# Altium project MT3608.PrjPcb
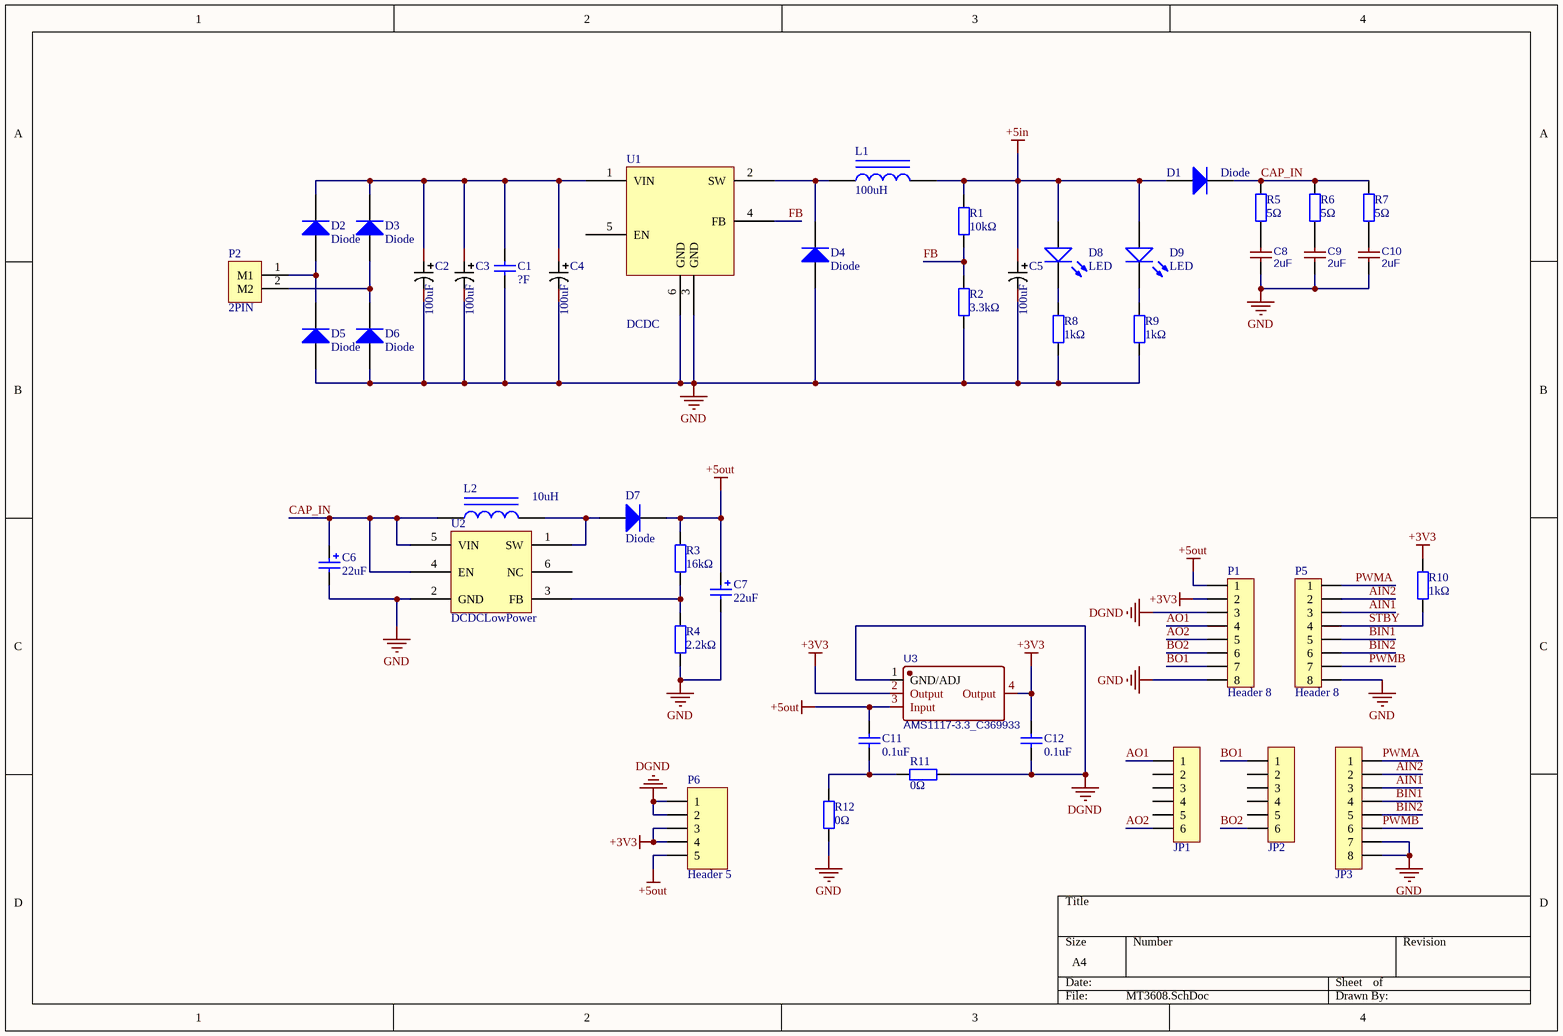
[diagram p0: MT3608.SchDoc]
1 sheet, 45 parts. Net scope: global (net labels, ports and power ports of the same name join across sheets).
Board file: MT3608.PcbDoc

## Sheet MT3608.SchDoc
size A4; SheetNumber: 1; SheetTotal: 1

### Parts
C1  ?F  [0603_C]
C2  100uF  [CM E(8*10.2)]
C3  100uF  [CM E(8*10.2)]
C4  100uF  [CM E(8*10.2)]
C5  100uF  [CM E(8*10.2)]
C6  22uF  [CASE-C_6032]
C7  22uF  [CASE-C_6032]
C8  2uF  [CAP-TH_L23.0-W10.0-P20.00-D1.4]
C9  2uF  [CAP-TH_L23.0-W10.0-P20.00-D1.4]
C10  2uF  [CAP-TH_L23.0-W10.0-P20.00-D1.4]
C11  0.1uF  [0603_C]
C12  0.1uF  [0603_C]
D1  Diode  [SMA(DO-214AC)_S1]
D2  Diode  [SMA(DO-214AC)_S2]
D3  Diode  [SMA(DO-214AC)_S2]
D4  Diode  [SMA(DO-214AC)_S1]
D5  Diode  [SMA(DO-214AC)_S2]
D6  Diode  [SMA(DO-214AC)_S2]
D7  Diode  [SMA(DO-214AC)_S1]
D8  LED  [0805_LED]
D9  LED  [0805_LED]
JP1  HDR-1X6  [HDR2.54-WS-6P]  (value not drawn)
JP2  HDR-1X6  [HDR2.54-WS-6P]  (value not drawn)
JP3  HDR-1X8  [HDR2.54-WS-8P]  (value not drawn)
L1  100uH  [CDRH127]
L2  10uH  [CDRH73]
P1  Header 8  [Header 8]
P2  2PIN  [KF128-2P]
P5  Header 8  [Header 8]
P6  Header 5  [HDR2.54-WS-5P]
R1  10kΩ  [0603_R]
R2  3.3kΩ  [0603_R]
R3  16kΩ  [0603_R]
R4  2.2kΩ  [0603_R]
R5  5Ω  [0603_R]
R6  5Ω  [0603_R]
R7  5Ω  [0603_R]
R8  1kΩ  [0603_R]
R9  1kΩ  [0603_R]
R10  1kΩ  [0603_R]
R11  0Ω  [1206_R]
R12  0Ω  [1206_R]
U1  DCDC  [TO-252-XL]
U2  DCDCLowPower  [SOT95P290X145-6N]
U3  AMS1117-3.3_C369933  [SOT-223-4_L6.5-W3.5-P2.30-LS7.0-BR]

### Nets
+3V3: C12.2 P1.2 P6.3 P6.4 R10.2 U3.2(Output) U3.4(Output)
+5in: C5.1 D1.1(A) D8.A D9.A L1.2 R1.2
+5out: C7.1 C11.2 D7.2(K) P1.1 P6.5 R3.2 U3.3(Input)
DGND: C12.1 P1.3 P6.1 P6.2 R11.1 U3.1(GND/ADJ)
GND: C1.1 C2.2 C3.2 C4.2 C5.2 C6.2 C7.2 C8.1 C9.1 C10.1 D4.1(A) D5.1(A) D6.1(A) JP3.7 JP3.8 P1.8 P5.8 R2.1 R4.1 R8.1 R9.1 R12.1 U1.3(GND) U1.6(GND) U2.2(GND)
AIN1: JP3.3 P5.3
AIN2: JP3.2 P5.2
AO1: JP1.1 P1.4
AO2: JP1.6 P1.5
BIN1: JP3.4 P5.5
BIN2: JP3.5 P5.6
BO1: JP2.1 P1.7
BO2: JP2.6 P1.6
CAP_IN: C6.1 D1.2(K) L2.1 R5.2 R6.2 R7.2 U2.4(EN) U2.5(VIN)
FB: R1.1 R2.2 U1.4(FB)
PWMA: JP3.1 P5.1
PWMB: JP3.6 P5.7
STBY: P5.4 R10.1
NetC1_2: C1.2 C2.1 C3.1 C4.1 D2.2(K) D3.2(K) U1.1(VIN)
NetC8_2: C8.2 R5.1
NetC9_2: C9.2 R6.1
NetC10_2: C10.2 R7.1
NetC11_1: C11.1 R11.2 R12.2
NetD2_1: D2.1(A) D5.2(K) P2.1(M1)
NetD3_1: D3.1(A) D6.2(K) P2.2(M2)
NetD4_2: D4.2(K) L1.1 U1.2(SW)
NetD7_1: D7.1(A) L2.2 U2.1(SW)
NetD8_K: D8.K R8.2
NetD9_K: D9.K R9.2
NetR3_1: R3.1 R4.2 U2.3(FB)

Not connected (* = marked no-connect by the designer): JP1 2 3 4 5; JP2 2 3 4 5; U1 5(EN); U2 6(NC)

### Library data of the parts
C1 C11 C12 = SMT_Cap: 贴片电容; ComponentLink1Description: 供应商链接; ComponentLink1URL: http://www.szlcsc.com/product/details_29010.html; Package: 0805; Supplier: LC; SuppliersPartNumber: C28260
C2-C5 = SMT_Cap_Electrolytic: 贴片电容; ComponentLink1Description: 供应商链接; ComponentLink1URL: http://www.szlcsc.com/product/details_29010.html; Package: 0805; Supplier: LC; SuppliersPartNumber: C28260
C6 C7 = SMT_Cap_Tantalum: 钽电容; ComponentLink1Description: 供应商链接; ComponentLink1URL: http://www.szlcsc.com/product/details_16815.html; Package: 3528; Supplier: LC; SuppliersPartNumber: C16133
C8-C10 = 2uF-CBB: CBB，2uF电容; BOM_Manufacturer: SRD; BOM_Manufacturer Part: MPP205J4241119LC; nameAlias: Capacitance; BOM_Supplier: LCSC; BOM_Supplier Part: C93266; BOM_JLCPCB Part Class: Extended Part; spicePre: C; spiceSymbolName: MPP205J4241119LC
D1-D7 = Diode: 通用二极管; ComponentLink1Description: 供应商链接; ComponentLink1URL: http://www.szlcsc.com/product/details_9093.html; Package: SOD-123; Supplier: LC; SuppliersPartNumber: C8598
D8 D9 = LED: 发光二极管; ComponentLink1Description: 供应商链接; ComponentLink1URL: http://www.szlcsc.com/product/details_2663.html; Package: 0603; Supplier: LC; SuppliersPartNumber: C2290
JP1 JP2 = Header 6: 6P接插件; 封装库来自淘宝卖家  ID：黄晶宝石: 其他店铺购入均为盗版假冒封装库，请立即申请退款; 技术支持， 联系售后: 唯一出售店铺网址https://shop463601444.taobao.com; BOM名称: 6P接插件
JP3 = Header 8: 8P接插件; 封装库来自淘宝卖家  ID：黄晶宝石: 其他店铺购入均为盗版假冒封装库，请立即申请退款; 技术支持， 联系售后: 唯一出售店铺网址https://shop463601444.taobao.com; BOM名称: 8P接插件
L1 L2 = SMT_Iud_Power: 功率电感; ComponentLink1Description: 供应商链接; ComponentLink1URL: http://www.szlcsc.com/product/details_30010.html; Package: 0603; Supplier: LC; SuppliersPartNumber: C29258
P1 P5 = Header 8: 排针
P2 = 接线端子-2PIN
P6 = Header 5: 排针
R1-R12 = SMT_Res: 贴片电阻; ComponentLink1Description: 供应商链接; ComponentLink1URL: http://www.szlcsc.com/product/details_23980.html; Package: 0603; Supplier: LC; SuppliersPartNumber: C23253
U1 = XL7015: 宽输入DCDC升降压管理芯片（Buck）
U2 = MT3608: The MT3608 is a constant frequency, 6-pin SOT23 / current mode step-up converter intended for small, / low power applications. The MT3608 switches at / 1.2MHz and allows the use of tiny, low cost / capacitors and inductors 2mm or less in height. / Internal soft-start results in small inrush current and / extends battery life. / The MT3608 features automatic shifting to pulse / frequency modulation mode at light loads. The / MT3608 includes under-voltage lockout, current / limiting, and thermal overload protection to prevent / damage in the event of an output overload. The / MT3608 is available in a small 6-pin SOT-23 / package
U3 = AMS1117-3.3_C369933: BOM_Manufacturer: KEXIN; Contributor: LCSC; BOM_Supplier: LCSC; BOM_Supplier Part: C369933; BOM_Manufacturer Part: AMS1117-3.3; BOM_JLCPCB Part Class: Extended Part; spicePre: U; spiceSymbolName: AMS1117-3.3_C369933